# EAGLE design transceiver-AX5043-v1 (EAGLE 9.5.1)
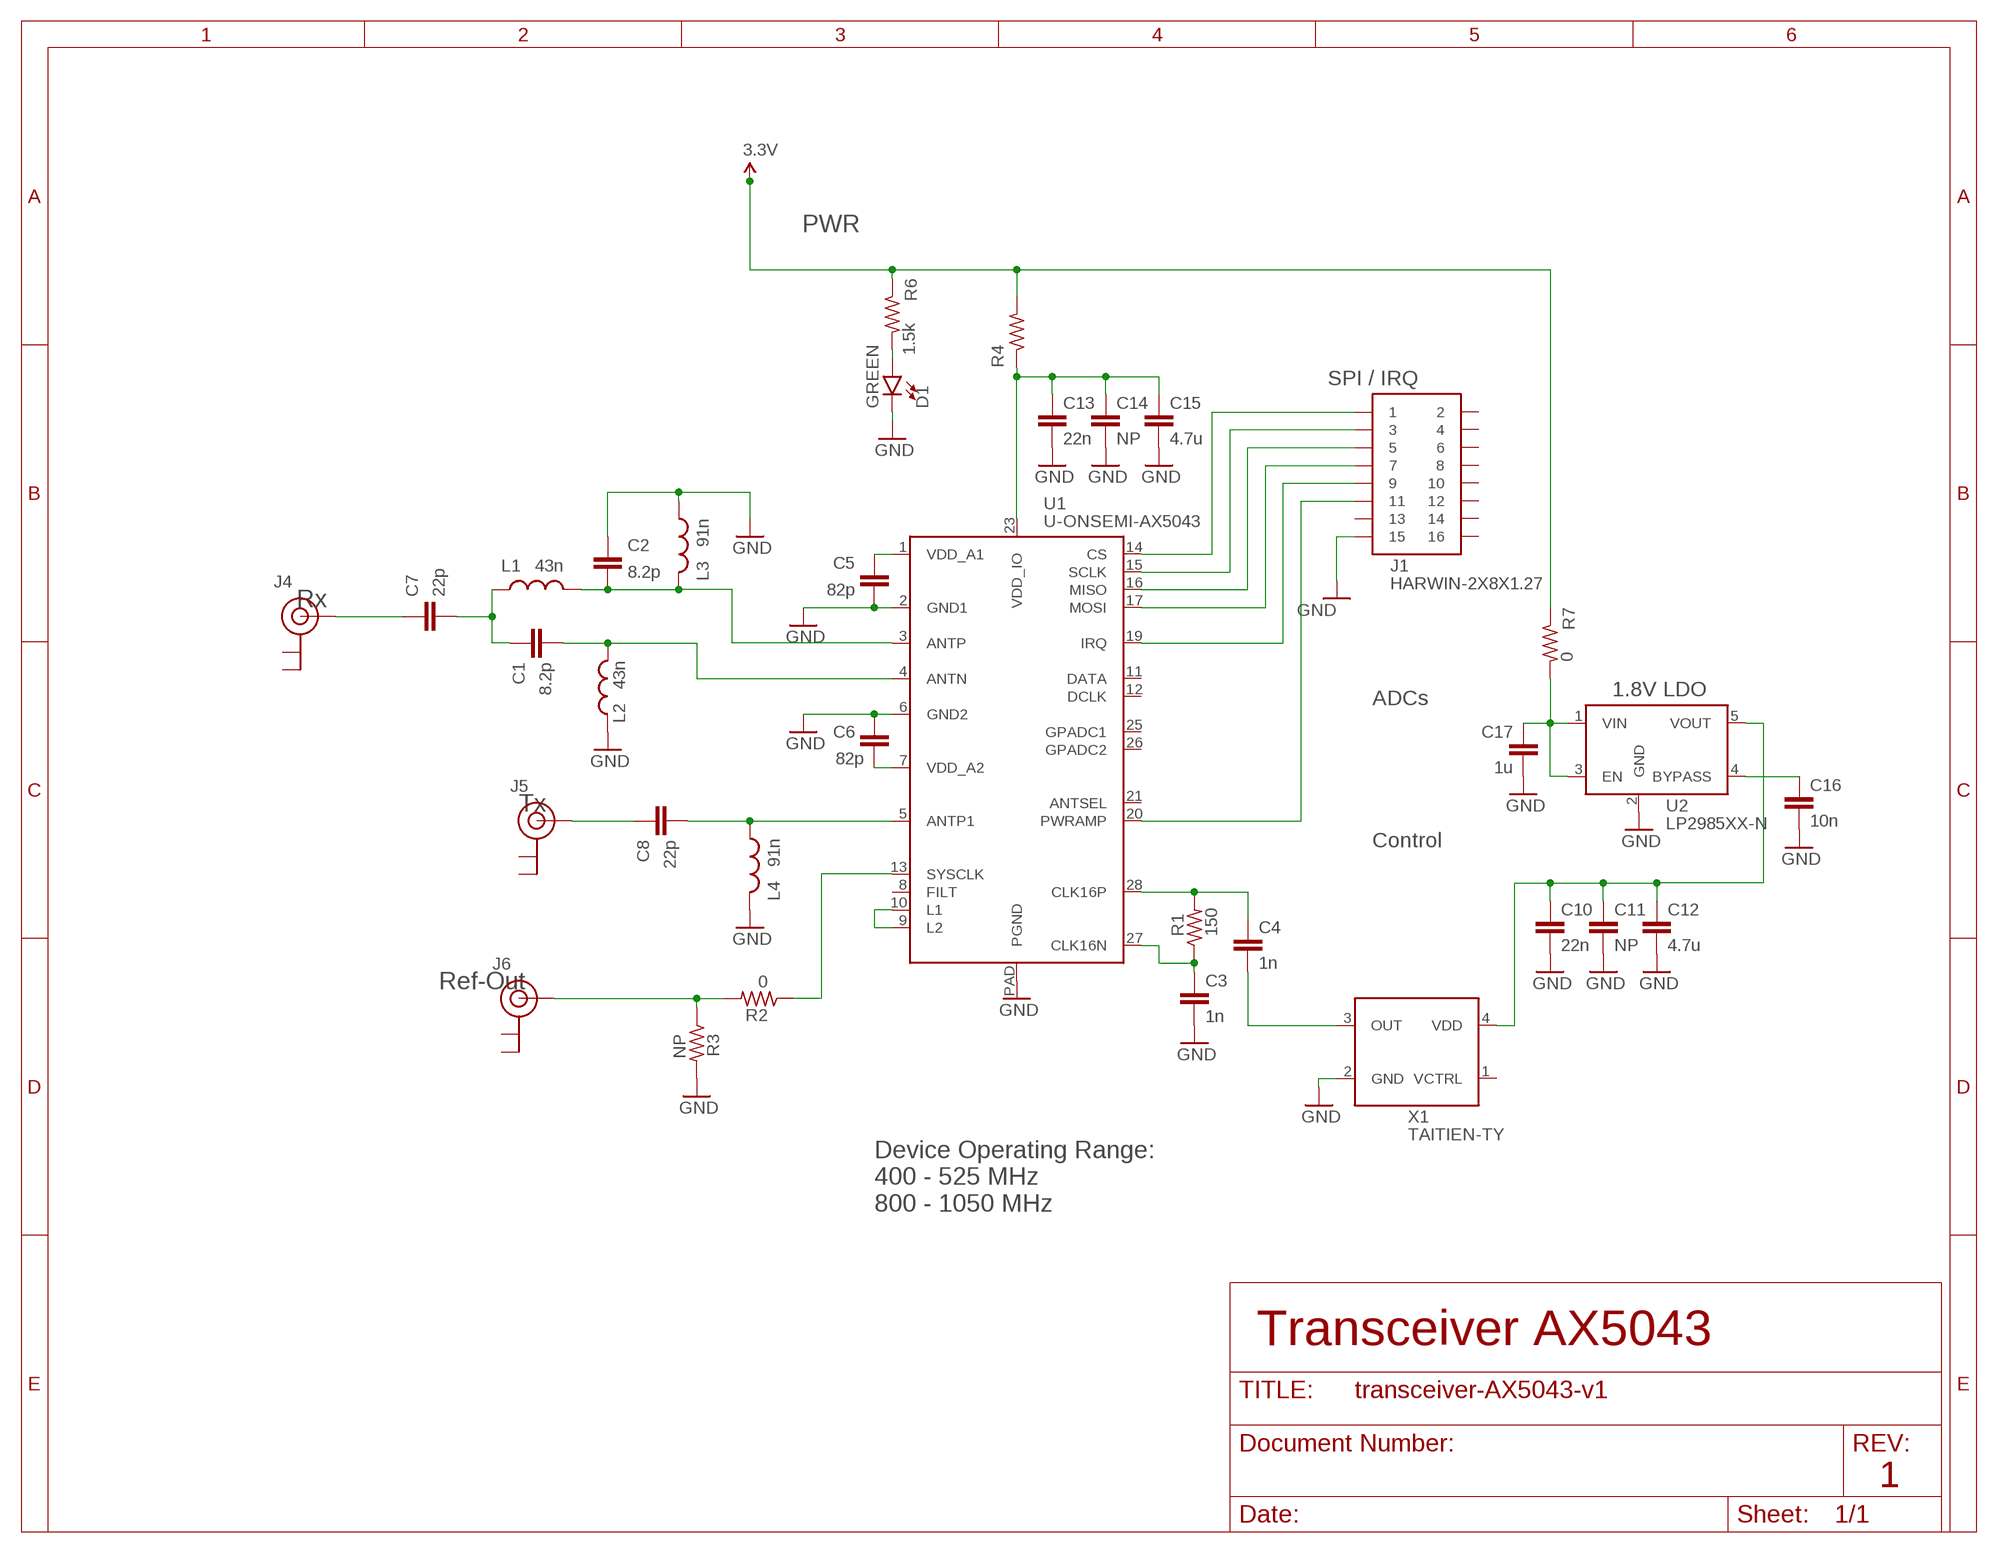
[diagram p0: schematic, sheet 1]

## Parts
C1  8.2p  C-EU0402-C-NOSILK  [.0402-C-NOSILK]
C2  8.2p  C-EU0402-C-NOSILK  [.0402-C-NOSILK]
C3  1n  C-EU0402-C-NOSILK  [.0402-C-NOSILK]
C4  1n  C-EU0402-C-NOSILK  [.0402-C-NOSILK]
C5  82p  C-EU0402-C-NOSILK  [.0402-C-NOSILK]
C6  82p  C-EU0402-C-NOSILK  [.0402-C-NOSILK]
C7  22p  C-EU0402-C-NOSILK  [.0402-C-NOSILK]
C8  22p  C-EU0402-C-NOSILK  [.0402-C-NOSILK]
C10  22n  C-EU0603-C-NOSILK  [.0603-C-NOSILK]
C11  NP  C-EU0603-C-NOSILK  [.0603-C-NOSILK]
C12  4.7u  C-EU0603-C-NOSILK  [.0603-C-NOSILK]
C13  22n  C-EU0603-C-NOSILK  [.0603-C-NOSILK]
C14  NP  C-EU0603-C-NOSILK  [.0603-C-NOSILK]
C15  4.7u  C-EU0603-C-NOSILK  [.0603-C-NOSILK]
C16  10n  C-EU0603-C-NOSILK  [.0603-C-NOSILK]
C17  1u  C-EU0603-C-NOSILK  [.0603-C-NOSILK]
D1  GREEN  LED-GREEN0603  [LED-0603]
J1  HARWIN-2X8X1.27  [2X8X1.27]
J4  U.FL  [U.FL]
J5  U.FL  [U.FL]
J6  U.FL  [U.FL]
L1  43n  L-US0402-C-NOSILK  [.0402-C-NOSILK]
L2  43n  L-US0402-C-NOSILK  [.0402-C-NOSILK]
L3  91n  L-US0603-C-NOSILK  [.0603-C-NOSILK]
L4  91n  L-US0603-C-NOSILK  [.0603-C-NOSILK]
R1  150  R-US_0402-C-NOSILK  [.0402-C-NOSILK]
R2  0  R-US_0402-C-NOSILK  [.0402-C-NOSILK]
R3  NP  R-US_0402-C-NOSILK  [.0402-C-NOSILK]
R4  0  R-US_0603-C-NOSILK  [.0603-C-NOSILK]
R6  1.5k  R-US_0603-B-NOSILK  [.0603-B-NOSILK]
R7  0  R-US_0603-C-NOSILK  [.0603-C-NOSILK]
U1  U-ONSEMI-AX5043  [QFN28-5X5-WITH-CENTER-PAD]
U2  LP2985XX-N  [SOT-23]
X1  TAITIEN-TY  [2.5X2.0]

## Nets
1V8: C10.1 C11.1 C12.1 U2.5(VOUT) X1.4(VDD)
3.3V: C13.1 C14.1 C15.1 C17.1 R4.1 R4.2 R6.1 R7.1 R7.2 U1.23(VDD_IO) U2.1(VIN) U2.3(EN)
ANTN: C1.2 L2.2 U1.4(ANTN)
ANTP [RF1]: C2.2 L1.2 L3.1 U1.3(ANTP)
ANTP1 [RF1]: C8.2 L4.2 U1.5(ANTP1)
CLKN: C3.1 R1.1 U1.27(CLK16N)
CLKP: C4.1 R1.2 U1.28(CLK16P)
CS: J1.1 U1.14(CS)
GND: C2.1 C3.2 C5.2 C6.1 C10.2 C11.2 C12.2 C13.2 C14.2 C15.2 C16.2 C17.2 D1.C J1.15 L2.1 L3.2 L4.1 R3.2 U1.2(GND1) U1.6(GND2) U1.PAD(PGND) U2.2(GND) X1.2(GND)
IRQ: J1.9 U1.19(IRQ)
LEDPWR: D1.A R6.2
MISO: J1.5 U1.16(MISO)
MOSI: J1.7 U1.17(MOSI)
N$1: C5.1 U1.1(VDD_A1)
N$3: U1.9(L2) U1.10(L1)
N$6 [RF2]: C4.2 X1.3(OUT)
N$20 [RF2]: C1.1 C7.2 L1.1
N$27: C16.1 U2.4(BYPASS)
N$30: C6.2 U1.7(VDD_A2)
PWRAMP: J1.11 U1.20(PWRAMP)
REF-OUT [RF1]: J6.FEED(SIGNAL) R2.2 R3.1
RX [RF1]: C7.1 J4.FEED(SIGNAL)
SCLK: J1.3 U1.15(SCLK)
SYSCLK [RF1]: R2.1 U1.13(SYSCLK)
TX [RF1]: C8.1 J5.FEED(SIGNAL)
Unconnected: J1.2 J1.4 J1.6 J1.8 J1.10 J1.12 J1.13 J1.14 J1.16 J4.1(GND) J4.2(GND) J5.1(GND) J5.2(GND) J6.1(GND) J6.2(GND) U1.8(FILT) U1.11(DATA) U1.12(DCLK) U1.21(ANTSEL) U1.25(GPADC1) U1.26(GPADC2) X1.1(VCTRL)

## Notes on the sheet
- PWR
- SPI / IRQ
- Rx
- 1.8V LDO
- ADCs
- Tx
- Control
- Ref-Out
- Device Operating Range:
  400 - 525 MHz
  800 - 1050 MHz
- Transceiver AX5043
- 1

## Library data of the parts
C1-C8 C10-C17 = oresat-rcl:C-EU: CAPACITOR, European symbol
D1 = SparkFun-LED:LED-GREEN: Green SMD LED Used in manufacturing of various products at SparkFun Packages: 0603 - SMD 0603 package [Product Link] <http://www.futureelectronics.com/en/technologies/semiconductors/optoelectronics/leds/Pages/9894312-LTST-C190GKT.aspx?CrossPart=HSMG-C190&IM=0> LilyPad 1206 - SMD1206 LilyPad package [Product Link] <http://www.futureelectronics.com/en/Technologies/Product.aspx?ProductID=IN150NGHARVATEKCORPORATION2049943&IM=0> 1206 - SMD1206 package [Product Link] <http://www.futureelectronics.com/en/technologies/semiconductors/optoelectronics/leds/Pages/8315665-LTST-C150KGKT.aspx?IM=0> 1206 Bottom Mount -SMD 1206 Bottom Mount [Product Link] <http://www.digikey.com/product-detail/en/lite-on-inc/LTST-C230KGKT/160-1456-1-ND/386854> SparkFun Products: Pro Mini 328 -5V <https://www.sparkfun.com/products/821> RedBoard <https://www.sparkfun.com/products/12757> MP3 Trigger <https://www.sparkfun.com/products/13720> Makey Makey <https://www.sparkfun.com/products/11076>
J1 = J-Harwin-M50-3610842R-2X8X1.27_Male :HARWIN-2X8X1.27
J4-J6 = SparkFun-Connectors:U.FL: SMD Antenna Connector - U.FL 2mm height, 3.0mm x 3.0mm receptacle size. SparkFun Products: SparkFun WiFi Shield - ESP8266 <https://www.sparkfun.com/products/13287> SparkFun ESP8266 Thing <https://www.sparkfun.com/products/13231> SparkFun MiniGen - Pro Mini Signal Generator Shield <https://www.sparkfun.com/products/11420>; PROD_ID: CONN-09193; SF_ID: WRL-09144
L1-L4 = oresat-rcl:L-US: INDUCTOR, American symbol
R1-R4 R6 R7 = oresat-rcl:R-US_: RESISTOR, American symbol
U1 = U-ON-Semi-AX5043-radio:U-ONSEMI-AX5043
U2 = U-TI-LP2985XX-N-linear-reg:LP2985XX-N: TI 150mA Low Noise LDO Regulators LP2985-N (various fixed >2.0V) Source: Datasheet <http://www.ti.com/product/LP2985-N?qgpn=lp2985-n> LP2985LV-N (1.5, 1.8, 2.0V fixed) Source: Datasheet <http://www.ti.com/product/LP2985LV-N?qgpn=lp2985lv-n>
X1 = X-Taitien-TY-TCXO:TAITIEN-TY: Clipped Sine Wave TCXO Stability: 1.0ppm (-40 to +85 ℃) Source: Datasheet <https://www.taitien.com/wp-content/uploads/2015/12/XO-0081_TY.pdf>

## Net classes
1 RF1: clearance 0.8 mm
2 RF2: clearance 0.4 mm

## Board
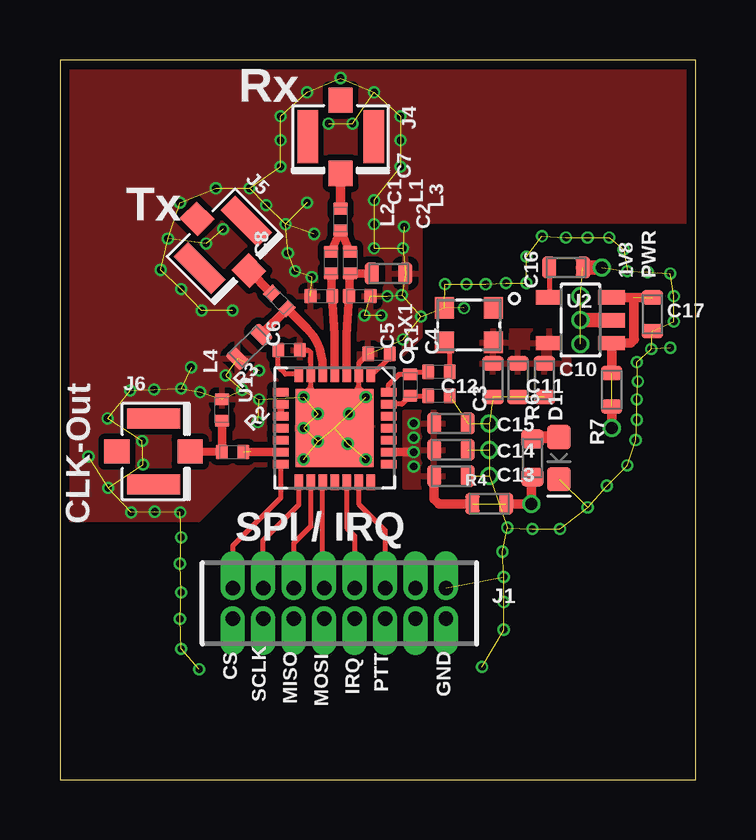
[diagram p1: board, top side]
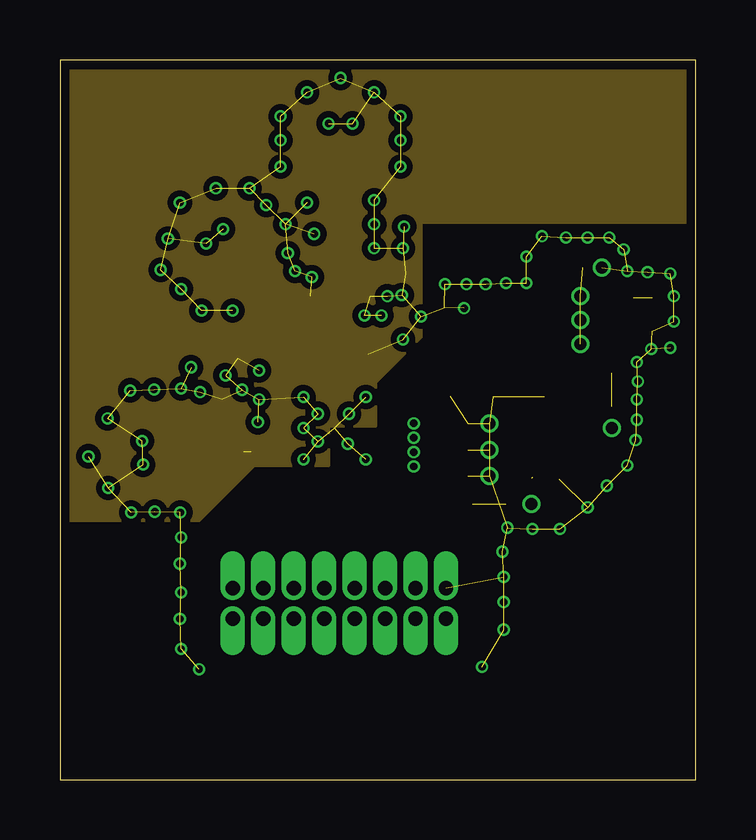
[diagram p2: board, inner layer Route2]
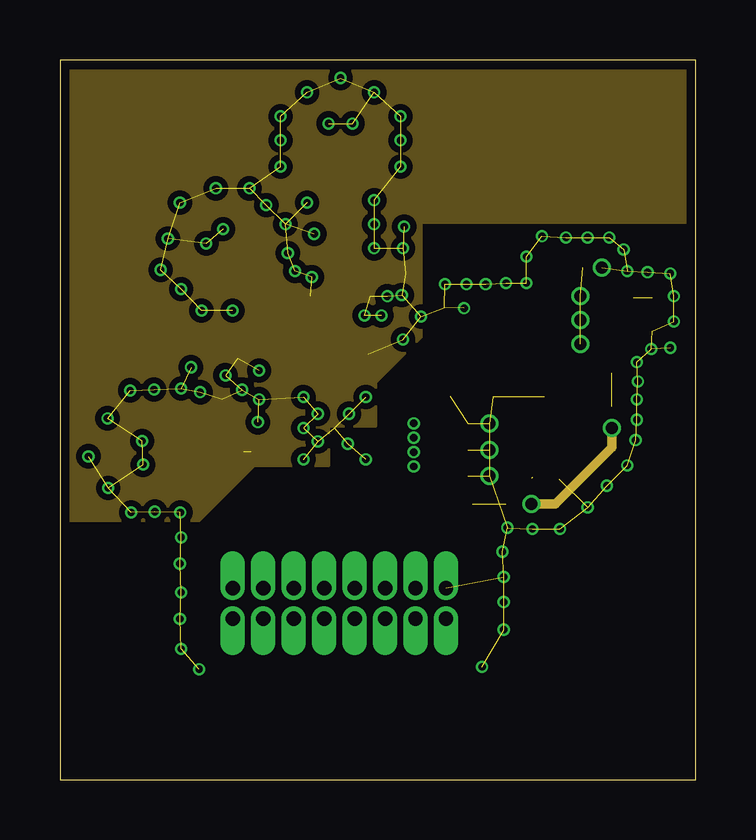
[diagram p3: board, inner layer Route15]
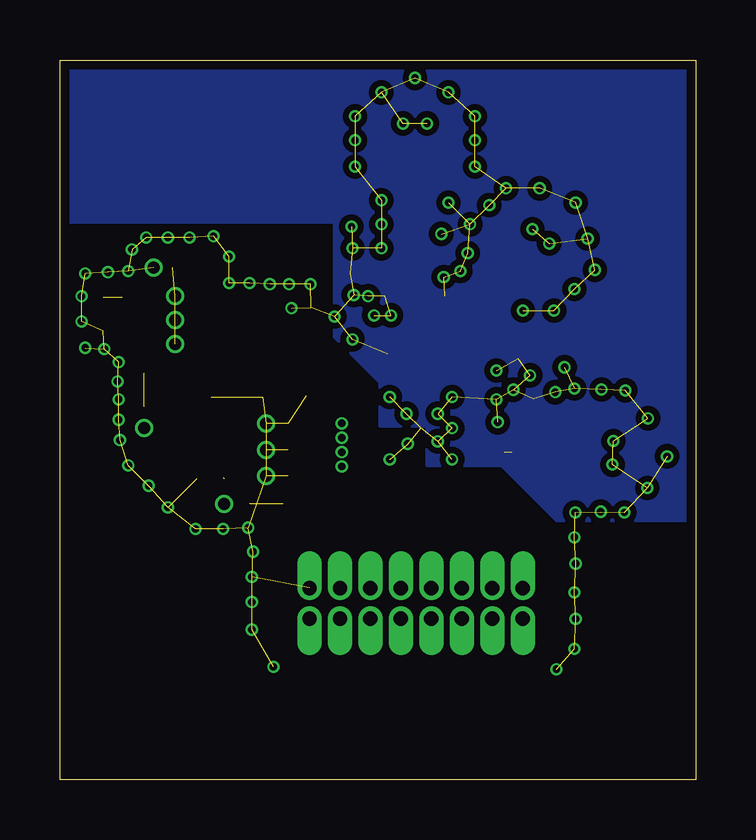
[diagram p4: board, bottom side, seen from below]

Size 26.5 x 30 mm. Coordinates in mm from the lower left corner, seen from the top.
Outline: 0,0 26.5,0 26.5,30 0,30 0,0
Copper layers (1*2*15*16): Top 0.035559375mm / dielectric 0.17018125mm / Route2 0.01778125mm / dielectric 47mil / Route15 0.01778125mm / dielectric 0.17018125mm / Bottom 0.035559375mm
Design rules "oshpark-4layer-tented": minimum track width 5mil, minimum drill 10mil, track to track 5mil, track to pad 5mil, pad to pad 5mil, via to via 5mil, smd to smd 5mil, copper to edge 15mil, drill to drill 6mil, minimum pad ring 4mil, minimum via ring 4mil, stop-mask expansion 2.5mil, vias tented up to drill 20mil, thermal gap 10mil

### Footprints (pad centres in the part's own frame; a part is rotated, then mirrored left to right if it is on the bottom)
.0402-C-NOSILK = smd 0.5 x 0.6: 1 -0.45,0; 2 0.45,0
.0603-C-NOSILK = smd 0.6 x 0.9: 1 -0.7,0; 2 0.7,0
LED-0603 = smd 1 x 1: A -0.877,0; C 0.877,0
2X8X1.27 = drill 0.6 pad 1.016 offset: 1 -4.445,0.635; 2 -4.445,-0.635; 3 -3.175,0.635; 4 -3.175,-0.635; 5 -1.905,0.635; 6 -1.905,-0.635; 7 -0.635,0.635; 8 -0.635,-0.635; 9 0.635,0.635; 10 0.635,-0.635; 11 1.905,0.635; 12 1.905,-0.635; 13 3.175,0.635; 14 3.175,-0.635; 15 4.445,0.635; 16 4.445,-0.635
U.FL = smd 2.2 x 0.85: 1 0,1.375; 2 0,-1.375 | smd 1.05 x 1: FEED 1.525,0; NC -1.525,0
.0603-B-NOSILK = smd 0.8 x 0.95: 1 -0.8,0; 2 0.8,0
QFN28-5X5-WITH-CENTER-PAD = smd 0.65 x 0.35: 1 -2.25,1.5; 2 -2.25,1; 3 -2.25,0.5; 4 -2.25,0; 5 -2.25,-0.5; 6 -2.25,-1; 7 -2.25,-1.5; 15 2.25,-1.5; 16 2.25,-1; 17 2.25,-0.5; 18 2.25,0; 19 2.25,0.5; 20 2.25,1; 21 2.25,1.5 | smd 0.35 x 0.65: 8 -1.5,-2.25; 9 -1,-2.25; 10 -0.5,-2.25; 11 0,-2.25; 12 0.5,-2.25; 13 1,-2.25; 14 1.5,-2.25; 22 1.5,2.25; 23 1,2.25; 24 0.5,2.25; 25 0,2.25; 26 -0.5,2.25; 27 -1,2.25; 28 -1.5,2.25 | smd 3.25 x 3.25: PAD 0,0
SOT-23 = smd 1.1 x 0.6: 1 -1.3,0.95; 2 -1.3,0; 3 -1.3,-0.95; 4 1.3,-0.95; 5 1.3,0.95
2.5X2.0 = smd 0.8 x 0.9: 1 -1.025,-0.725; 2 1.025,-0.725; 3 1.025,0.725; 4 -1.025,0.725

### Placement (x,y rotation side)
C1  11.3,21.55 270 top
C2  12.5,20.15 180 top
C3  15.8,16 0 top
C4  15.8,17 0 top
C5  13.3,17.75 180 top
C6  9.55,17.9 180 top
C7  11.7,23.35 270 top
C8  9.15,19.95 315 top
C10  20.2,16.65 270 top
C11  19.1,16.65 270 top
C12  18.05,16.65 270 top
C13  16.3,12.65 0 top
C14  16.3,13.75 0 top
C15  16.3,14.85 0 top
C16  21.1,21.35 0 top
C17  24.7,19.4 270 top
D1  20.8,13.4 270 top
J1  11.65,7.35 0 top
J4  11.7,26.8 270 top
J5  6.8,22.3 315 top
J6  3.9,13.68 0 top
L1  12.1,21.55 270 top
L2  10.9,20.15 0 top
L3  13.7,21.1 0 top
L4  7.9,18.05 45 top
R1  14.6,16.45 90 top
R2  7.2,13.65 180 top
R3  6.75,15.41 90 top
R4  17.9,11.5 0 top
R6  19.7,13.4 90 top
R7  23,16.25 270 top
U1  11.45,14.65 270 top
U2  21.7,19.15 180 top
X1  17.05,18.95 180 top

### Tracks (layer width: path | path; a pad name or v marks a point on that pad's centre or on a via)
1V8
  pour Top: 17.55,16.95 21.25,16.95 21.25,17.65 20.75,17.65 20.75,18.75 17.55,18.75
3.3V  (via drill 0.3, 0.5)  (4 unrouted)
  Top 0.35: U1.23 v14.75,13.65
  Top 0.4: U2.3 C17.1 | 23.9,20.1 23.92,20.08 23.92,18.35 23.94,18.34 23.8,18.2 U2.1 R7.1 | v23,14.65 R7.2 | 19.65,12.55 v19.65,11.5 R4.2 | C13.1 15.6,11.7 15.8,11.5 R4.1
  Route15 0.4: v19.65,11.5 20.65,11.5 23,13.85 v23,14.65
  other vias: 14.75,13.05 14.75,14.25 14.75,14.85
  pour Top (isolate 0.016): 14.35,12.15 16,12.15 16,15.35 14.35,15.35
ANTN
  Top 0.35: U1.4 11.45,18.55 L2.2 C1.2
ANTP
  Top 0.35: U1.3 11.95,18.55 C2.2 L1.2 L3.1
ANTP1
  Top 0.35: U1.5 10.95,17.22 arc45 10.29,18.81 C8.2 9.47,19.62 L4.2
CLKN
  Top 0.2: C3.1 R1.1 14.25,15.65 U1.27
CLKP
  Top 0.2: U1.28 13.7,16.45 14.15,16.9 R1.2 14.7,17 C4.1
CS
  Top 0.2: U1.14 9.2,11.75 7.2,9.75 J1.1
GND  (via drill 0.3, 0.5)  (130 unrouted)
  Top 0.2: C5.2 12.45,17.35 U1.2 12.45,16.26 | U1.6 10.45,16.25 | C6.1 10.36,17.9 10.45,17.81 U1.6 | U1.6
  Top 0.35: 10.45,16.25 v10.15,15.95 | 12.45,16.26 12.74,16.01 v12.75,15.95
  Top 0.6: U2.2 v21.7,19.15 | C16.2 v22.6,21.35
  other vias: 21.7,18.15 21.7,20.15 16.85,19.65 17.75,20.65 14.3,18.35 17.9,12.65 17.9,13.75 17.9,14.85 12.75,13.35 10.15,13.35 10.15,14.65 10.75,15.25 10.75,14.1 12,14 12.05,15.25 9.2,27.65 9.2,26.65 10.3,28.65 9.2,25.55 10.3,24.05 10.6,22.75 14.2,27.65 14.2,25.55 13.1,28.65 14.2,26.65 13.1,24.15 13.1,22.15 10.5,20.95 9.8,21.2 12.7,19.35 7.6,16.25 13.1,23.15 13.65,20.15 16.05,20.65 14.3,22.15 6.9,16.85 7.2,19.55 4.5,22.55 7.9,24.65 6.5,24.65 5,24.05 6.1,22.35 5.9,19.55 5.05,20.45 4.2,21.25 9.4,23.15 9.5,21.95 8.6,23.95 2.93,16.22 1.98,15.06 3.92,16.26 1.19,13.47 5.05,16.3 2.01,12.16 3.96,11.17 5.02,11.13 5.85,16.15 8.25,14.9 2.97,11.13 3.43,14.12 12.2,27.35 3.46,13.13 11.2,27.35 5.46,17.19 5.8,4.6 18.5,7.4 18.5,8.45 19.7,10.45 20.85,10.45 18.65,10.5 22,11.35 18.5,6.25 17.6,4.7 22.9,22.6 22,22.6 21.1,22.6 20.1,22.65 19.45,21.8 19.45,20.7 18.6,20.7 11.7,29.25 6.8,22.95 24,14.15 5.05,10.1 5.05,7.8 5,9 5.05,5.45 5,6.7 22.8,12.25 8.3,15.85 8.3,17.05 14.25,20.2 24.5,21.15 15.05,19.3 14.35,23.05 16.95,20.65 25.6,20.15 25.45,21.1 24.1,16.6 24.05,15 23.65,13.1 24.05,17.4 24.05,15.85 24.65,17.95 18.45,9.5 23.5,22.1 23.65,21.2 25.45,18 25.6,19.1 13.4,19.35
  pour Top (isolate 0.254, rank 6): 0,30 0,10.8 5.8,10.8 8.1,13.1 11.2,13.1 11.2,14.75 13.15,14.75 13.15,16.55 15.05,18.45 15.05,23.25 26.5,23.25 26.5,30
GND1
  pour Bottom (isolate 0.254, rank 6): 0,30 0,10.8 5.8,10.8 8.1,13.1 11.2,13.1 11.2,14.75 13.15,14.75 13.15,16.55 15.05,18.45 15.05,23.25 26.5,23.25 26.5,30
  pour Route2 (isolate 0.254, rank 6): 0,30 0,10.8 5.8,10.8 8.1,13.1 11.2,13.1 11.2,14.75 13.15,14.75 13.15,16.55 15.05,18.45 15.05,23.25 26.5,23.25 26.5,30
  pour Route15 (isolate 0.254, rank 6): 0,30 0,10.8 5.8,10.8 8.1,13.1 11.2,13.1 11.2,14.75 13.15,14.75 13.15,16.55 15.05,18.45 15.05,23.25 26.5,23.25 26.5,30
IRQ
  Top 0.2: U1.19 11.95,10.5 12.29,10.16 J1.9
LEDPWR
  Top 0.5: R6.2 19.78,14.28 D1.A
MISO
  Top 0.2: U1.16 10.45,10.55 9.74,9.85 J1.5
MOSI
  Top 0.2: J1.7 10.95,8.05 U1.17
N$1
  Top 0.2: 13.75,17.6 13.05,16.9 U1.1
  Top 0.35: C5.1 13.75,17.6
N$3
  Top 0.3: U1.9 U1.10
N$6
  Top 0.2: X1.3 16.05,18.25 16.1,18.25 16.25,18.1 C4.2
N$20
  Top 0.35: L1.1 C7.2 C1.1
N$27
  Top 0.2: C16.1 U2.4
N$30
  Top 0.2: U1.7 9.4,16.9 9.1,17.2 C6.2
PWRAMP
  Top 0.2: U1.20 12.45,11.5 13.55,10.39 J1.11
REF-OUT
  Top 0.35: J6.FEED R2.2 R3.1
  Top 0.39: 6.75,13.64 R2.2
RX
  Top 0.39: C7.1 J4.FEED
SCLK
  Top 0.2: U1.15 9.95,11.45 8.45,9.95 8.45,8.01 J1.3
SYSCLK  (1 unrouted)
  Top 0.35: U1.13 7.97,13.65
TX
  Top 0.39: C8.1 J5.FEED

### Text on the board
tPlace: Rx | Tx | 1V8 | PWR | CLK-Out | SPI / IRQ | CS | IRQ | PTT | SCLK | MISO | MOSI | GND